# Altium schematic sheet Buck converter demo.schdoc
size 244 x 191 mm
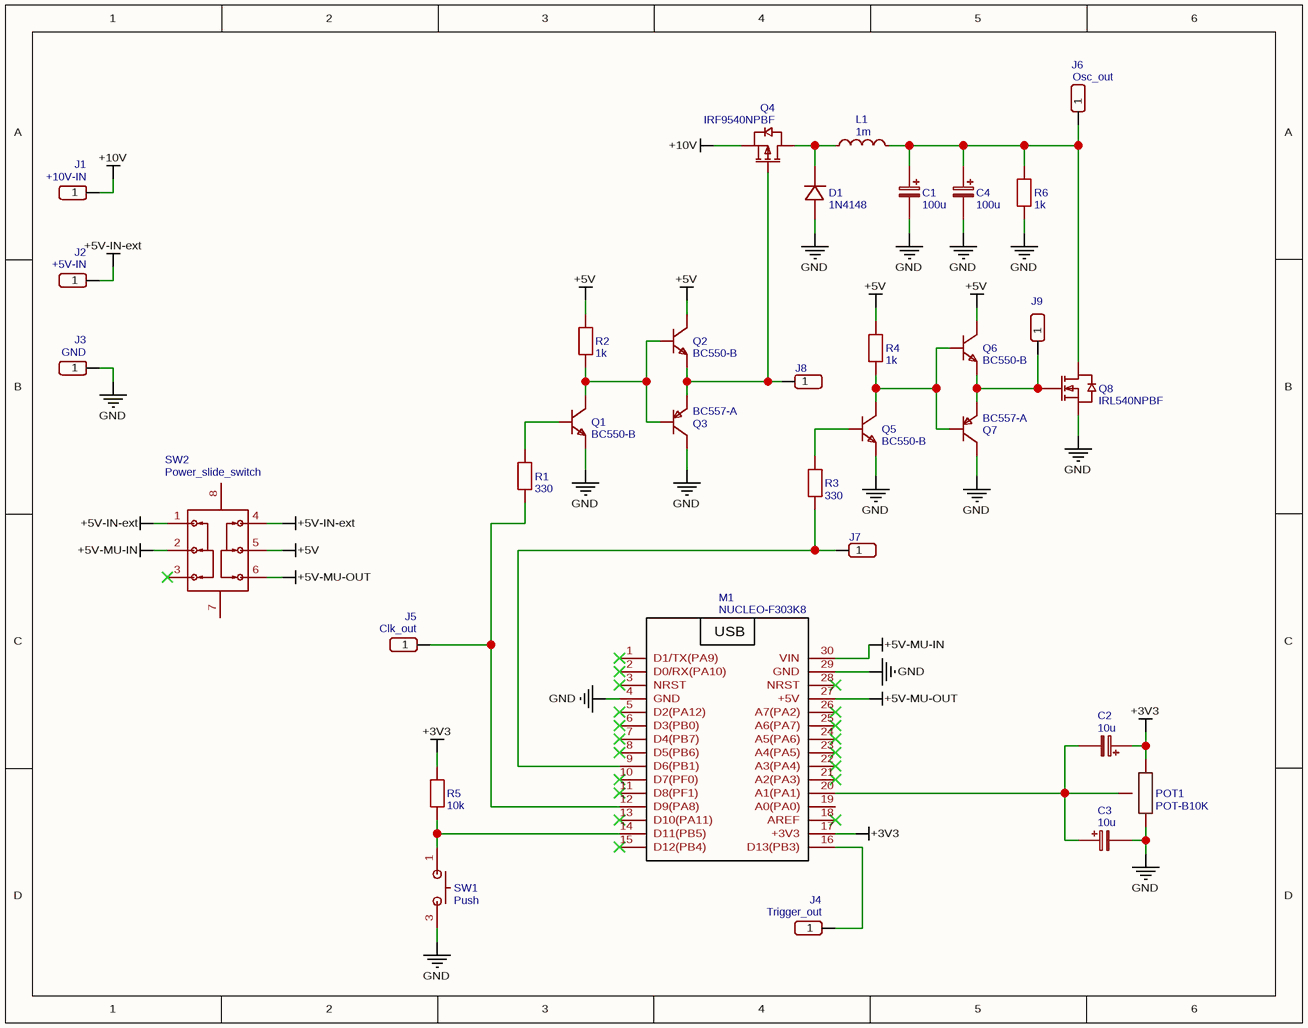
[diagram p0: Buck converter demo.schdoc]

## Parts
C1  100u  [CASE-A_3216]
C2  10u  [CASE-A_3216]
C3  10u  [CASE-A_3216]
C4  100u  [CASE-A_3216]
D1  1N4148  [DO-35_BD2.0-L4.0-P8.00-D0.5-FD]
J1  +10V-IN  [HDR-M-2.54_1X1]
J2  +5V-IN  [HDR-M-2.54_1X1]
J3  GND  [HDR-M-2.54_1X1]
J4  Trigger_out  [HDR-M-2.54_1X1]
J5  Clk_out  [HDR-M-2.54_1X1]
J6  Osc_out  [HDR-M-2.54_1X1]
J7  Osc_out  [HDR-M-2.54_1X1]  (value not drawn)
J8  Osc_out  [HDR-M-2.54_1X1]  (value not drawn)
J9  Osc_out  [HDR-M-2.54_1X1]  (value not drawn)
L1  1m  [L0603]
M1  NUCLEO-F303K8  [NUCLEO-32]
POT1  POT-B10K  [POT-B10K]
Q1  BC550-B  [TO-92-3_L4.8-W3.7-P2.54-L]
Q2  BC550-B  [TO-92-3_L4.8-W3.7-P2.54-L]
Q3  BC557-A  [TO-92-3_L4.8-W3.7-P2.54-L]
Q4  IRF9540NPBF  [TO-220-3_L10.0-W4.5-P2.54-L]
Q5  BC550-B  [TO-92-3_L4.8-W3.7-P2.54-L]
Q6  BC550-B  [TO-92-3_L4.8-W3.7-P2.54-L]
Q7  BC557-A  [TO-92-3_L4.8-W3.7-P2.54-L]
Q8  IRL540NPBF  [TO-220-3_L10.0-W4.5-P2.54-T]
R1  330  [R0603]
R2  1k  [R0603]
R3  330  [R0603]
R4  1k  [R0603]
R5  10k  [R0603]
R6  1k  [R0603]
SW1  Push  [SW-TH_L8.0-W5.11-P5.08_TP11SH8CQE]
SW2  Power_slide_switch  [SW-TH_KH-SK22D07-G5]

## Nets
+3V3: C2.1 M1.17(+3V3) POT1.2 R5.2
+5V: Q2.3(C) Q6.3(C) R2.2 R4.2 SW2.5
+5V-IN-ext: J2.1 SW2.1 SW2.4
+5V-MU-IN: M1.30(VIN) SW2.2
+5V-MU-OUT: M1.27(+5V) SW2.6
+10V: J1.1 Q4.3(S)
GND: C1.2 C3.2 C4.2 D1.1(A) J3.1 M1.4(GND) M1.29(GND) POT1.1 Q1.1(E) Q3.1(C) Q5.1(E) Q7.1(C) Q8.3(S) R6.1 SW1.3
NetC1_1: C1.1 C4.1 J6.1 L1.2 Q8.2(D) R6.2
NetC2_2: C2.2 C3.1 M1.20(A1(PA1)) POT1.3
NetD1_2: D1.2(C) L1.1 Q4.2(D)
NetJ4_1: J4.1 M1.16(D13(PB3))
NetJ5_1: J5.1 M1.12(D9(PA8)) R1.1
NetJ7_1: J7.1 M1.9(D6(PB1)) R3.1
NetJ8_1: J8.1 Q2.1(E) Q3.3(E) Q4.1(G)
NetJ9_1: J9.1 Q6.1(E) Q7.3(E) Q8.1(G)
NetM1_14: M1.14(D11(PB5)) R5.1 SW1.1
NetQ1_2: Q1.2(B) R1.2
NetQ1_3: Q1.3(C) Q2.2(B) Q3.2(B) R2.1
NetQ5_2: Q5.2(B) R3.2
NetQ5_3: Q5.3(C) Q6.2(B) Q7.2(B) R4.1

Not connected (* = marked no-connect by the designer): M1 1(D1/TX(PA9))* 2(D0/RX(PA10))* 3(NRST)* 5(D2(PA12))* 6(D3(PB0))* 7(D4(PB7))* 8(D5(PB6))* 10(D7(PF0))* 11(D8(PF1))* 13(D10(PA11))* 15(D12(PB4))* 18(AREF)* 19(A0(PA0)) 21(A2(PA3))* 22(A3(PA4))* 23(A4(PA5))* 24(A5(PA6))* 25(A6(PA7))* 26(A7(PA2))* 28(NRST)*; SW2 3* 7 8

## Notes on the sheet
- (in symbol NUCLEO-F303K8) USB

## Library data of the parts
C1 C4 = 100u: nameAlias: Value(F); Contributor: LCEDA_Lib; spicePre: C; spiceSymbolName: C_Tan_SMD_A_EU
C2 C3 = 10u: nameAlias: Value(F); Contributor: LCEDA_Lib; spicePre: C; spiceSymbolName: C_Tan_SMD_A_EU
D1 = 1N4148: Manufacturer: ST(先科); Supplier: LCSC; Manufacturer Part: 1N4148; Supplier Part: C14516; JLCPCB Part Class: Extended Part; link: https://lcsc.com/eda_search?q=C14516&%26type=1&ref=editor; spicePre: D; spiceSymbolName: 1N4148
J1 = +10V-IN: Contributor: LCEDA_Lib; Supplier Part: C81276; Supplier: LCSC; spicePre: J; spiceSymbolName: HDR-M-2.54_1x1
J2 = +5V-IN: Contributor: LCEDA_Lib; Supplier Part: C81276; Supplier: LCSC; spicePre: J; spiceSymbolName: HDR-M-2.54_1x1
J3 = GND: Contributor: LCEDA_Lib; Supplier Part: C81276; Supplier: LCSC; spicePre: J; spiceSymbolName: HDR-M-2.54_1x1
J4 = Trigger_out: Contributor: LCEDA_Lib; Package Display: No; Supplier Part: C81276; Supplier: LCSC; spicePre: J; spiceSymbolName: HDR-M-2.54_1x1
J5 = Clk_out: Contributor: LCEDA_Lib; Package Display: No; Supplier Part: C81276; Supplier: LCSC; spicePre: J; spiceSymbolName: HDR-M-2.54_1x1
J6-J9 = Osc_out: Contributor: LCEDA_Lib; Package Display: No; Supplier Part: C81276; Supplier: LCSC; spicePre: J; spiceSymbolName: HDR-M-2.54_1x1
L1 = 1m: nameAlias: Value(H); Contributor: LCEDA_Lib; spicePre: L; spiceSymbolName: L0603_US
M1 = NUCLEO-F303K8: Contributor: dleval; Supplier: Mouser; Supplier Part: NUCLEO-F303K8; spicePre: M; spiceSymbolName: NUCLEO-F303K8
POT1 = POT-B10K: Contributor: Andrius Paurys; spicePre: P; spiceSymbolName: POT-B10K
Q1 Q2 Q5 Q6 = BC550-B: Manufacturer: BLUE ROCKET(蓝箭); Contributor: LCSC; Supplier: LCSC; Supplier Part: C358538; Manufacturer Part: BC550-B; JLCPCB Part Class: Extended Part; link: https://lcsc.com/eda_search?q=C358538&%26type=1&ref=editor; spicePre: Q; spiceSymbolName: BC550-B
Q3 Q7 = BC557-A: Manufacturer: onsemi(安森美); Manufacturer Part: BC560CTA; Contributor: LCSC; Supplier: LCSC; Supplier Part: C605309; JLCPCB Part Class: Extended Part; link: https://lcsc.com/eda_search?q=C605309&%26type=1&ref=editor; spicePre: Q; spiceSymbolName: BC560CTA
Q4 = IRF9540NPBF: Manufacturer: Infineon(英飞凌); Supplier: LCSC; Manufacturer Part: IRF9540NPBF; Supplier Part: C2575; JLCPCB Part Class: Extended Part; link: https://lcsc.com/eda_search?q=C2575&%26type=1&ref=editor; spicePre: Q; spiceSymbolName: IRF9540NPBF
Q8 = IRL540NPBF: Manufacturer: Infineon(英飞凌); Supplier: LCSC; Manufacturer Part: IRL540NPBF; Supplier Part: C111607; JLCPCB Part Class: Extended Part; link: https://lcsc.com/eda_search?q=C111607&%26type=1&ref=editor; spicePre: Q; spiceSymbolName: IRL540NPBF
R1 R3 = 330: nameAlias: Value(Ω); Contributor: LCEDA_Lib; spicePre: R; spiceSymbolName: R_0603_EU
R2 R4 R6 = 1k: nameAlias: Value(Ω); Contributor: LCEDA_Lib; spicePre: R; spiceSymbolName: R_0603_EU
R5 = 10k: nameAlias: Value(Ω); Contributor: LCEDA_Lib; spicePre: R; spiceSymbolName: R_0603_EU
SW1 = Push: Manufacturer: E-Switch; Manufacturer Part: 800AWSP9M2QE; Contributor: LCSC; Supplier: LCSC; Supplier Part: C273387; JLCPCB Part Class: Extended Part; link: https://lcsc.com/eda_search?q=C273387&%26type=1&ref=editor; spicePre: S; spiceSymbolName: 800AWSP9M2QE
SW2 = Power_slide_switch: Manufacturer: kinghelm(金航标); Manufacturer Part: KH-SK22D07-G5; Contributor: lcsc; Supplier: LCSC; Supplier Part: C5274511; link: https://lcsc.com/eda_search?q=C5274511&%26type=1&ref=editor; spicePre: U; spiceSymbolName: KH-SK22D07-G5